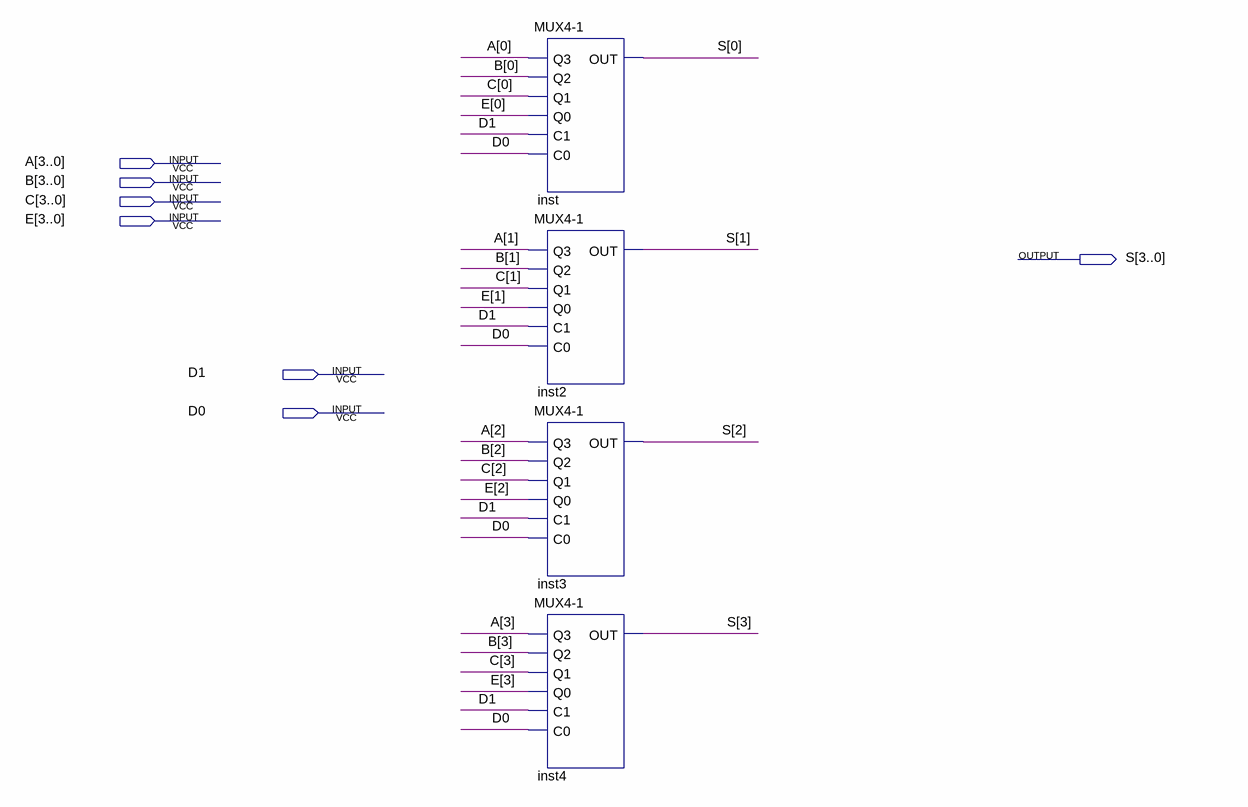
[diagram p0: schematic sheet]
// Quartus schematic mux4.bdf as structural Verilog: 4 symbols, 7 pins
module mux4 (
  input  [3:0] A,
  input  [3:0] B,
  input  [3:0] C,
  input  [3:0] E,
  input  D1,
  input  D0,
  output [3:0] S
);

  \MUX4-1  inst (.Q3(A[0]), .Q2(B[0]), .Q1(C[0]), .Q0(E[0]), .C1(D1), .C0(D0), .OUT(S[0]));
  \MUX4-1  inst2 (.Q3(A[1]), .Q2(B[1]), .Q1(C[1]), .Q0(E[1]), .C1(D1), .C0(D0), .OUT(S[1]));
  \MUX4-1  inst3 (.Q3(A[2]), .Q2(B[2]), .Q1(C[2]), .Q0(E[2]), .C1(D1), .C0(D0), .OUT(S[2]));
  \MUX4-1  inst4 (.Q3(A[3]), .Q2(B[3]), .Q1(C[3]), .Q0(E[3]), .C1(D1), .C0(D0), .OUT(S[3]));
endmodule
